# EasyEDA schematic LcsNodes-Main-Controller-Board-B.02.01.json

## Sheets
1 Controller: TITLE: LcsNodes-Main-Controller-Board-Pico\nLogic; REV: B.02.01; Date: 2022-09-17; Sheet: 2/3; Drawn By: helmut-f; Company: Your Company
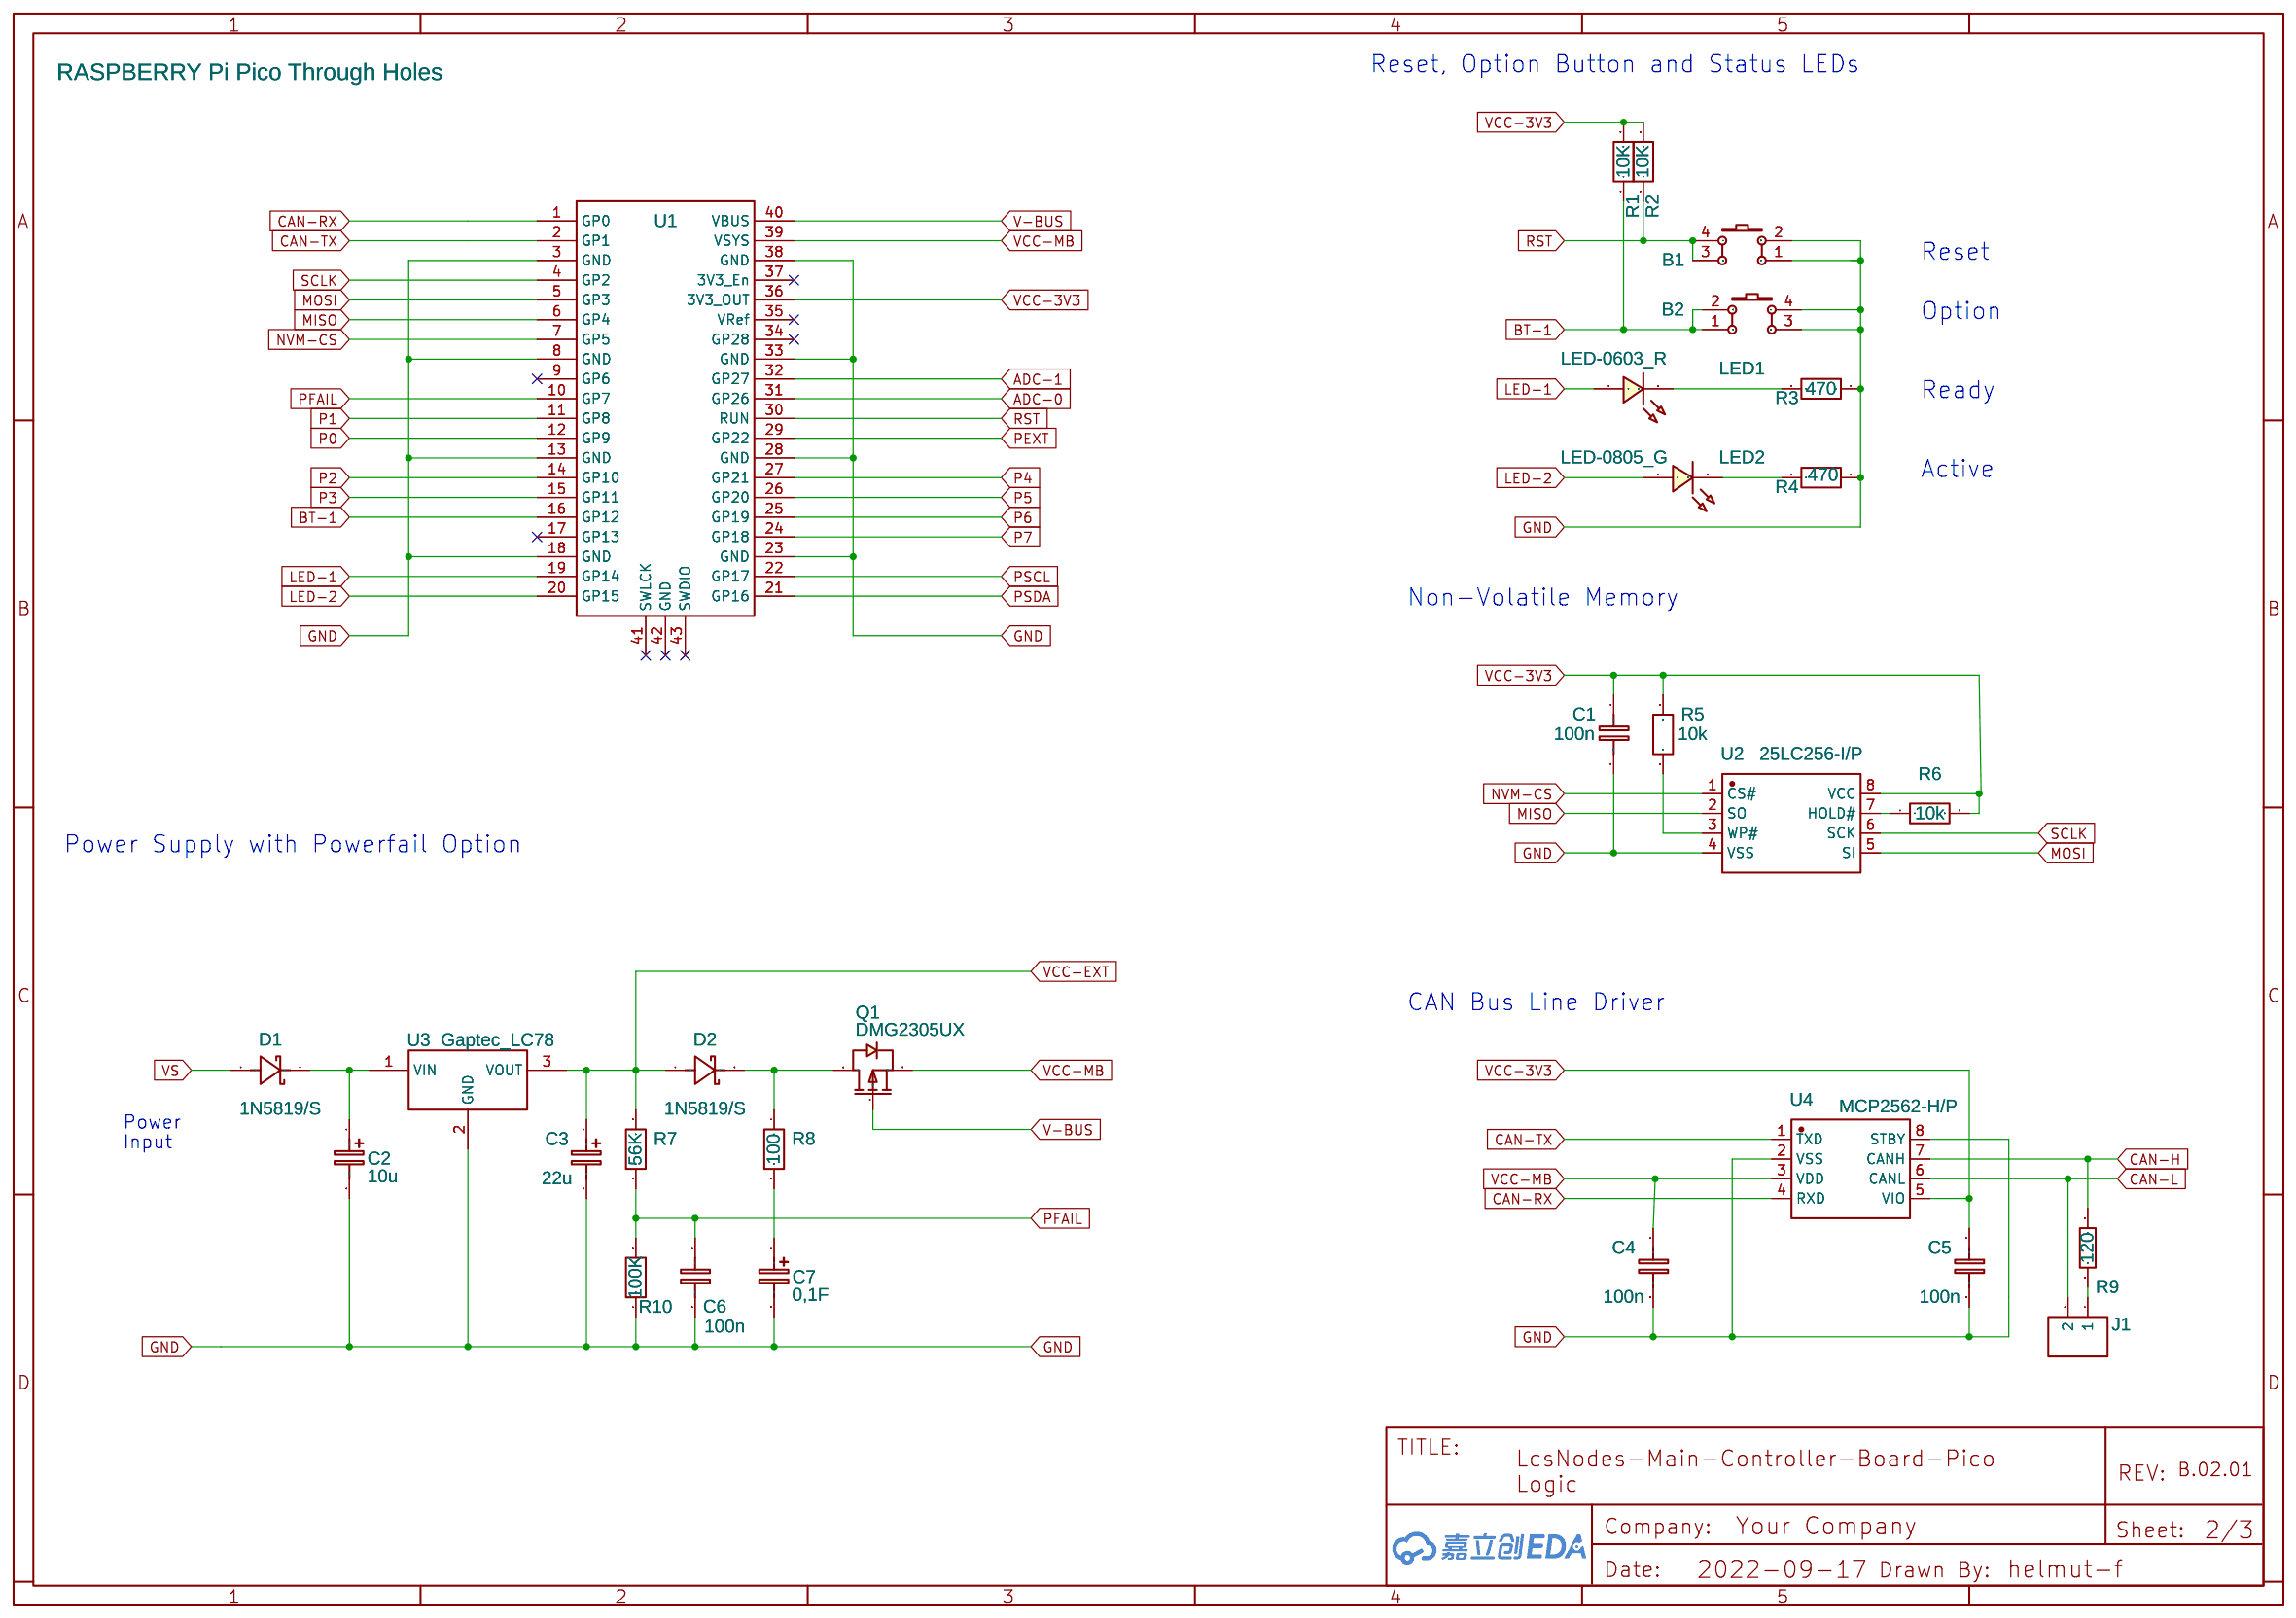
[diagram p0: Controller]
2 Connector: TITLE: LcsNodes-Main-Controller-Board-Pico\nConnectors, Level Shifters; Date: 2023-01-25; Sheet: 3/3
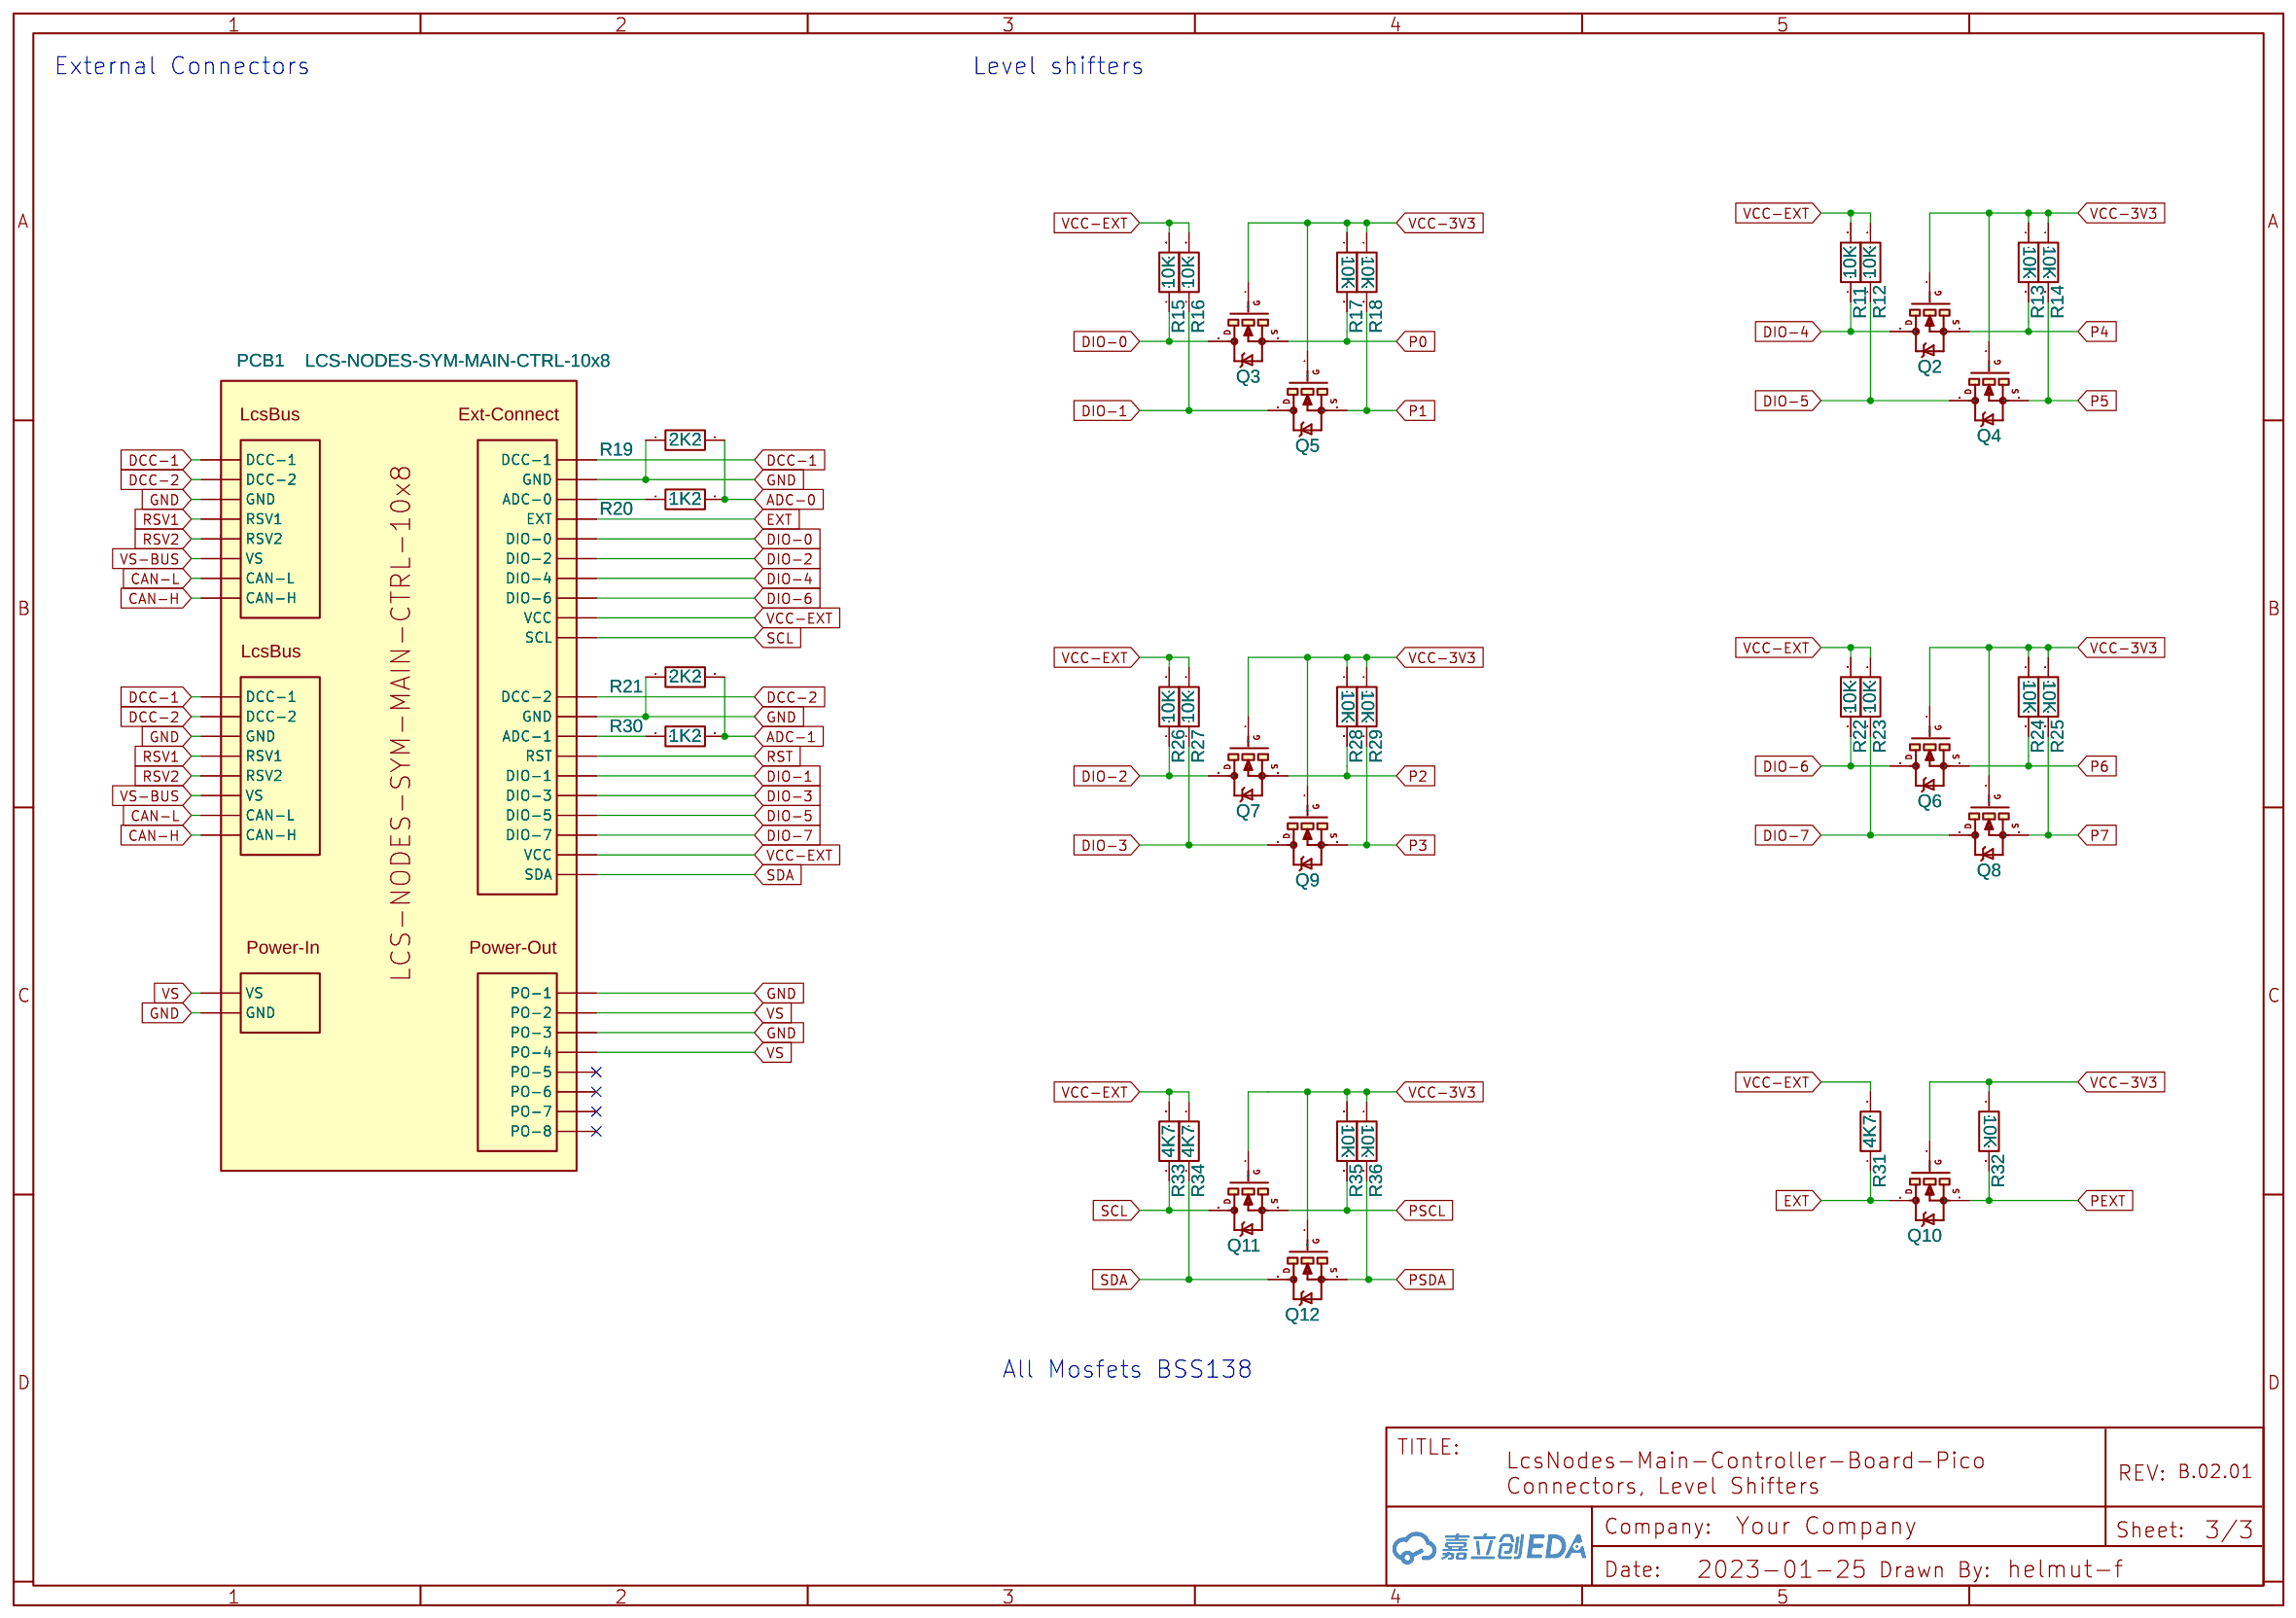
[diagram p1: Connector]
3 Block Diagram: TITLE: LcsNodes-Main-Controller-Board-PICO\nHigh Level Schematic; Date: 2023-02-08; Sheet: 1/3
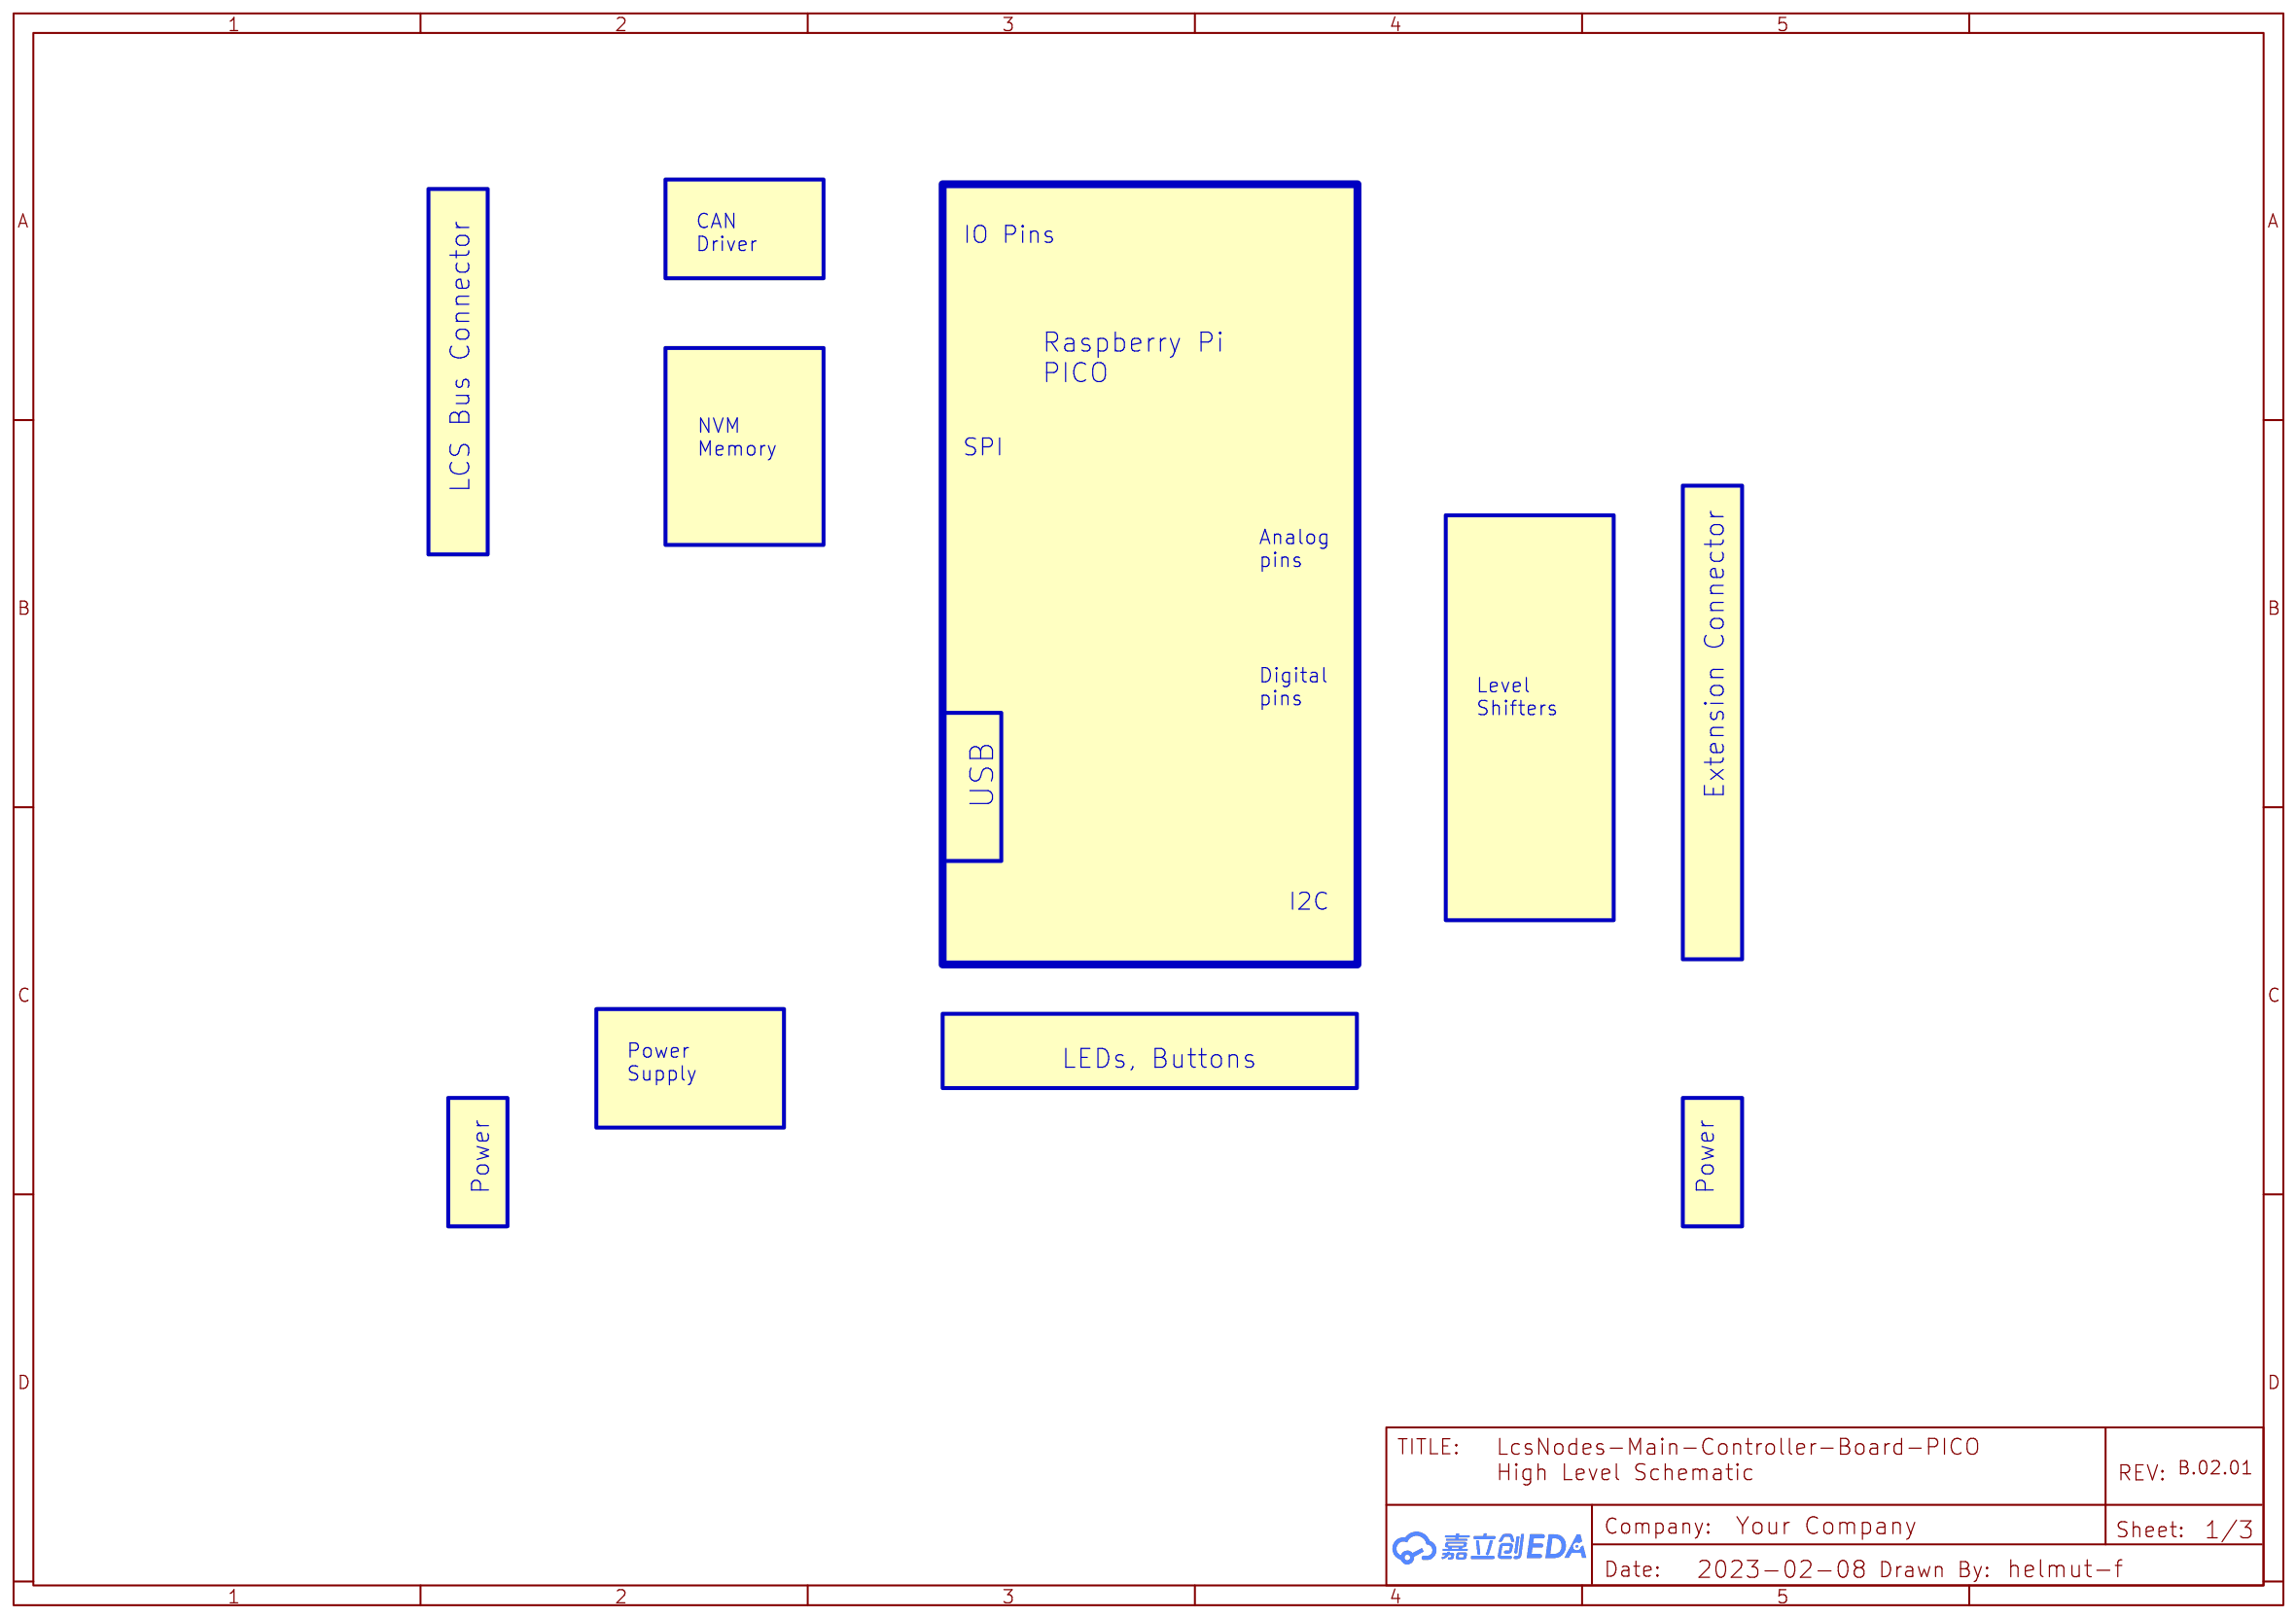
[diagram p2: Block Diagram]

## Parts
sheet Connector
PCB1  LCS-NODES-SYM-MAIN-CTRL-10x8  [LCS-NODES-FP-MAIN-CTRL-10X8]
Q2  MOSFET-NCHANNELBSS138  [SOT23-3]
Q3  MOSFET-NCHANNELBSS138  [SOT23-3]
Q4  MOSFET-NCHANNELBSS138  [SOT23-3]
Q5  MOSFET-NCHANNELBSS138  [SOT23-3]
Q6  MOSFET-NCHANNELBSS138  [SOT23-3]
Q7  MOSFET-NCHANNELBSS138  [SOT23-3]
Q8  MOSFET-NCHANNELBSS138  [SOT23-3]
Q9  MOSFET-NCHANNELBSS138  [SOT23-3]
Q10  MOSFET-NCHANNELBSS138  [SOT23-3]
Q11  MOSFET-NCHANNELBSS138  [SOT23-3]
Q12  MOSFET-NCHANNELBSS138  [SOT23-3]
R11  10K  [R1206]
R12  10K  [R1206]
R13  10K  [R1206]
R14  10K  [R1206]
R15  10K  [R1206]
R16  10K  [R1206]
R17  10K  [R1206]
R18  10K  [R1206]
R19  2K2  [R1206]
R20  1K2  [R1206]
R21  2K2  [R1206]
R22  10K  [R1206]
R23  10K  [R1206]
R24  10K  [R1206]
R25  10K  [R1206]
R26  10K  [R1206]
R27  10K  [R1206]
R28  10K  [R1206]
R29  10K  [R1206]
R30  1K2  [R1206]
R31  4K7  [R1206]
R32  10K  [R1206]
R33  4K7  [R1206]
R34  4K7  [R1206]
R35  10K  [R1206]
R36  10K  [R1206]
sheet Controller
B1  Reset  [KEY-TH_4P-L6.0-W6.0-P4.50-LS6.5]
B2  Opt  [KEY-TH_4P-L6.0-W6.0-P4.50-LS6.5]
C1  100n  [C1206]
C2  10u  [CAP-D5.0×H5.5]
C3  22u  [CAP-D5.0×H5.5]
C4  100n  [C1206]
C5  100n  [C1206]
C6  100n  [C1206]
C7  0,1F  [CAP-D12.5XF5.0]
D1  1N5819/S  [SMA_L4.3-W2.6-LS5.2-R-RD]
D2  1N5819/S  [SMA_L4.3-W2.6-LS5.2-R-RD]
J1  HDR-M-2.54_1x2  [HDR-M-2.54_1X2]
LED1  LED-0603_R  [LED-1206]
LED2  LED-0805_G  [LED-1206]
Q1  DMG2305UX  [SOT-23-3_L2.9-W1.3-P0.95-LS2.4-BR-1]
R1  10K  [R1206]
R2  10K  [R1206]
R3  470  [R1206]
R4  470  [R1206]
R5  10k  [R1206]
R6  10k  [R1206]
R7  56K  [R1206]
R8  100  [R1206]
R9  120  [R1206]
R10  100K  [R1206]
U1  RASPBERRY Pi Pico Through Holes  [RASPBERRY PI PICO]
U2  25LC256-I/P  [PDIP-8_L9.3-W6.4-P2.54-LS7.6-BL]
U3  Gaptec_LC78  [GAPTEC_LC78]
U4  MCP2562-H/P  [PDIP-8_L9.3-W6.4-P2.54-LS7.6-BL]

## Library data of the parts
PCB1 = LCS-NODES-SYM-MAIN-CTRL-10x8: Contributor: helmut-f; Package Display: No
Q2-Q12 = MOSFET-NCHANNELBSS138: Common NMOSFET Parts; Contributor: SparkFun
R1-R4 R11-R18 R22-R29 R31-R36 = R_0805_EU: Contributor: LCEDA_Lib
R5-R8 R10 R19-R21 R30 = R_AXIAL-0.3_EU: Contributor: LCEDA_Lib
B1 B2 = K4-6×6_TH: Supplier: LCSC; Supplier Part: C136684; Manufacturer: 韩国韩荣; Manufacturer Part: K2-1102DP-E4SW-04; Contributor: LCEDA_Lib; Package Display: No
C1 C4 C5 = C_0603_EU: Contributor: LCEDA_Lib; Package Display: No
C2 C3 = CE_SMD_D5.0×H5.5_EU: Contributor: LCEDA_Lib
C6 = C_RAD-0.2_EU: Contributor: LCEDA_Lib
C7 = C_Tan_SMD_A_EU: Contributor: LCEDA_Lib
D1 D2 = 1N5819/S: Supplier: LCSC; Supplier Part: C9900003833; JLCPCB Part Class: Extended Part; Contributor: LCSC
J1 = HDR-M-2.54_1x2: Supplier Part: C124375; Supplier: LCSC; Contributor: LCEDA_Lib
LED1 = LED-0603_R: Manufacturer: EVERLIGHT(台湾亿光); Manufacturer Part: 19-217/R6C-AL1M2VY/3T; Supplier Part: C72044; Supplier: LCSC; Contributor: LCEDA_01
LED2 = LED-0805_G: Manufacturer: 国星光电; Manufacturer Part: NCD0805G1; Supplier Part: C84260; Contributor: LCEDA_Lib
Q1 = DMG2305UX: Supplier: LCSC; Supplier Part: C2940629; Manufacturer: TECH PUBLIC(台舟); link: https://atta.szlcsc.com//upload/public/pdf/source/20220124/672A40BC72F4DE27873D6595D2E3AF1A.pdf; Contributor: LCSC; JLCPCB Part Class: Extended Part
R9 = RESISTOR-AXIAL-0.1
U1 = RASPBERRY Pi Pico Through Holes: Contributor: untung91
U2 = 25LC256-I/P: Supplier: LCSC; Supplier Part: C511271; Manufacturer: Microchip Tech; Contributor: LCSC; JLCPCB Part Class: Extended Part
U3 = Gaptec_LC78: Contributor: SpicyMemeBoi
U4 = MCP2562-H/P: Supplier: LCSC; Supplier Part: C640348; Manufacturer: MICROCHIP(美国微芯); link: https://atta.szlcsc.comnull; Contributor: lcsc

## Nets
GND: B1.1 B1.2 B2.3 B2.4 C1.2 C2.2 C3.2 C4.2 C5.2 C6.2 C7.2 PCB1.3(GND) PCB1.13(GND) PCB1.21(GND) PCB1.31(GND) PCB1.41(GND) PCB1.50(PO-1) PCB1.51(PO-3) R3.1 R4.1 R10.1 R19.1 R21.1 U1.3(GND) U1.8(GND) U1.13(GND) U1.18(GND) U1.23(GND) U1.28(GND) U1.33(GND) U1.38(GND) U2.4(VSS) U3.2(GND) U4.2(VSS) U4.8(STBY)
VCC-3V3: C1.1 C5.1 Q2.1(G) Q3.1(G) Q4.1(G) Q5.1(G) Q6.1(G) Q7.1(G) Q8.1(G) Q9.1(G) Q10.1(G) Q11.1(G) Q12.1(G) R1.2 R2.2 R5.1 R6.2 R13.1 R14.1 R17.1 R18.1 R24.1 R25.1 R28.1 R29.1 R32.1 R35.1 R36.1 U1.36(3V3_OUT) U2.8(VCC) U4.5(VIO)
VCC-EXT: C3.1 D2.1(A) PCB1.38(VCC) PCB1.48(VCC) R7.2 R11.2 R12.2 R15.2 R16.2 R22.2 R23.2 R26.2 R27.2 R31.2 R33.2 R34.2 U3.3(VOUT)
VCC-MB: C4.1 Q1.2(S) U1.39(VSYS) U4.3(VDD)
ADC-0: R19.2 R20.2 U1.31(GP26)
ADC-1: R21.2 R30.2 U1.32(GP27)
BT-1: B2.1 B2.2 R1.1 U1.16(GP12)
CAN-H: PCB1.8(CAN-H) PCB1.18(CAN-H) R9.1 U4.7(CANH)
CAN-L: J1.2 PCB1.7(CAN-L) PCB1.17(CAN-L) U4.6(CANL)
CAN-RX: U1.1(GP0) U4.4(RXD)
CAN-TX: U1.2(GP1) U4.1(TXD)
DCC-1: PCB1.1(DCC-1) PCB1.11(DCC-1) PCB1.30(DCC-1)
DCC-2: PCB1.2(DCC-2) PCB1.12(DCC-2) PCB1.40(DCC-2)
DIO-0: PCB1.34(DIO-0) Q3.3(D) R15.1
DIO-1: PCB1.44(DIO-1) Q5.3(D) R16.1
DIO-2: PCB1.35(DIO-2) Q7.3(D) R26.1
DIO-3: PCB1.45(DIO-3) Q9.3(D) R27.1
DIO-4: PCB1.36(DIO-4) Q2.3(D) R11.1
DIO-5: PCB1.46(DIO-5) Q4.3(D) R12.1
DIO-6: PCB1.37(DIO-6) Q6.3(D) R22.1
DIO-7: PCB1.47(DIO-7) Q8.3(D) R23.1
EXT: PCB1.33(EXT) Q10.3(D) R31.1
LED-1: LED1.1 U1.19(GP14)
LED-2: LED2.1 U1.20(GP15)
MISO: U1.6(GP4) U2.2(SO)
MOSI: U1.5(GP3) U2.5(SI)
NVM-CS: U1.7(GP5) U2.1(CS#)
P0: Q3.2(S) R17.2 U1.12(GP9)
P1: Q5.2(S) R18.2 U1.11(GP8)
P2: Q7.2(S) R28.2 U1.14(GP10)
P3: Q9.2(S) R29.2 U1.15(GP11)
P4: Q2.2(S) R13.2 U1.27(GP21)
P5: Q4.2(S) R14.2 U1.26(GP20)
P6: Q6.2(S) R24.2 U1.25(GP19)
P7: Q8.2(S) R25.2 U1.24(GP18)
PEXT: Q10.2(S) R32.2 U1.29(GP22)
PFAIL: C6.1 R7.1 R10.2 U1.10(GP7)
PSCL: Q11.2(S) R35.2 U1.22(GP17)
PSDA: Q12.2(S) R36.2 U1.21(GP16)
RST: B1.3 B1.4 PCB1.43(RST) R2.1 U1.30(RUN)
RSV1: PCB1.4(RSV1) PCB1.14(RSV1)
RSV2: PCB1.5(RSV2) PCB1.15(RSV2)
SCL: PCB1.39(SCL) Q11.3(D) R33.1
SCLK: U1.4(GP2) U2.6(SCK)
SDA: PCB1.49(SDA) Q12.3(D) R34.1
V-BUS: Q1.1(G) U1.40(VBUS)
VS: D1.1(A) PCB1.20(VS) PCB1.54(PO-2) PCB1.55(PO-4)
VS-BUS: PCB1.6(VS) PCB1.16(VS)
Net-(C2-1): C2.1 D1.2(K) U3.1(VIN)
Net-(C7-1): C7.1 R8.2
Net-(D2-2): D2.2(K) Q1.3(D) R8.1
Net-(J1-1): J1.1 R9.2
Net-(LED1-2): LED1.2 R3.2
Net-(LED2-2): LED2.2 R4.2
Net-(PCB1-32): PCB1.32(ADC-0) R20.1
Net-(PCB1-42): PCB1.42(ADC-1) R30.1
Net-(R5-2): R5.2 U2.3(WP#)
Net-(R6-1): R6.1 U2.7(HOLD#)

Not connected (* = marked no-connect by the designer): PCB1 52(PO-5)* 53(PO-7)* 56(PO-6)* 57(PO-8)*; U1 9(GP6)* 17(GP13)* 34(GP28)* 35(VRef)* 37(3V3_En)* 41(SWLCK)* 42(GND)* 43(SWDIO)*

## Notes on the sheets
sheet 1
- Reset, Option Button and Status LEDs
- Reset
- Option
- Ready
- Active
- Non-Volatile Memory
- Power Supply with Powerfail Option
- CAN Bus Line Driver
- Power
- Input
sheet 2
- External Connectors
- Level shifters
- All Mosfets BSS138
sheet 3
- CAN
  Driver
- IO Pins
- Raspberry Pi
  PICO
- NVM
  Memory
- SPI
- LCS Bus Connector
- Analog
  pins
- Digital
  pins
- Level
  Shifters
- USB
- Extension Connector
- I2C
- Power
  Supply
- LEDs, Buttons
- Power
- Power
